# EAGLE schematic A500-EXT-IDE.v1.0.0 (EAGLE 9.0.0)

## Sheet 1 of 2
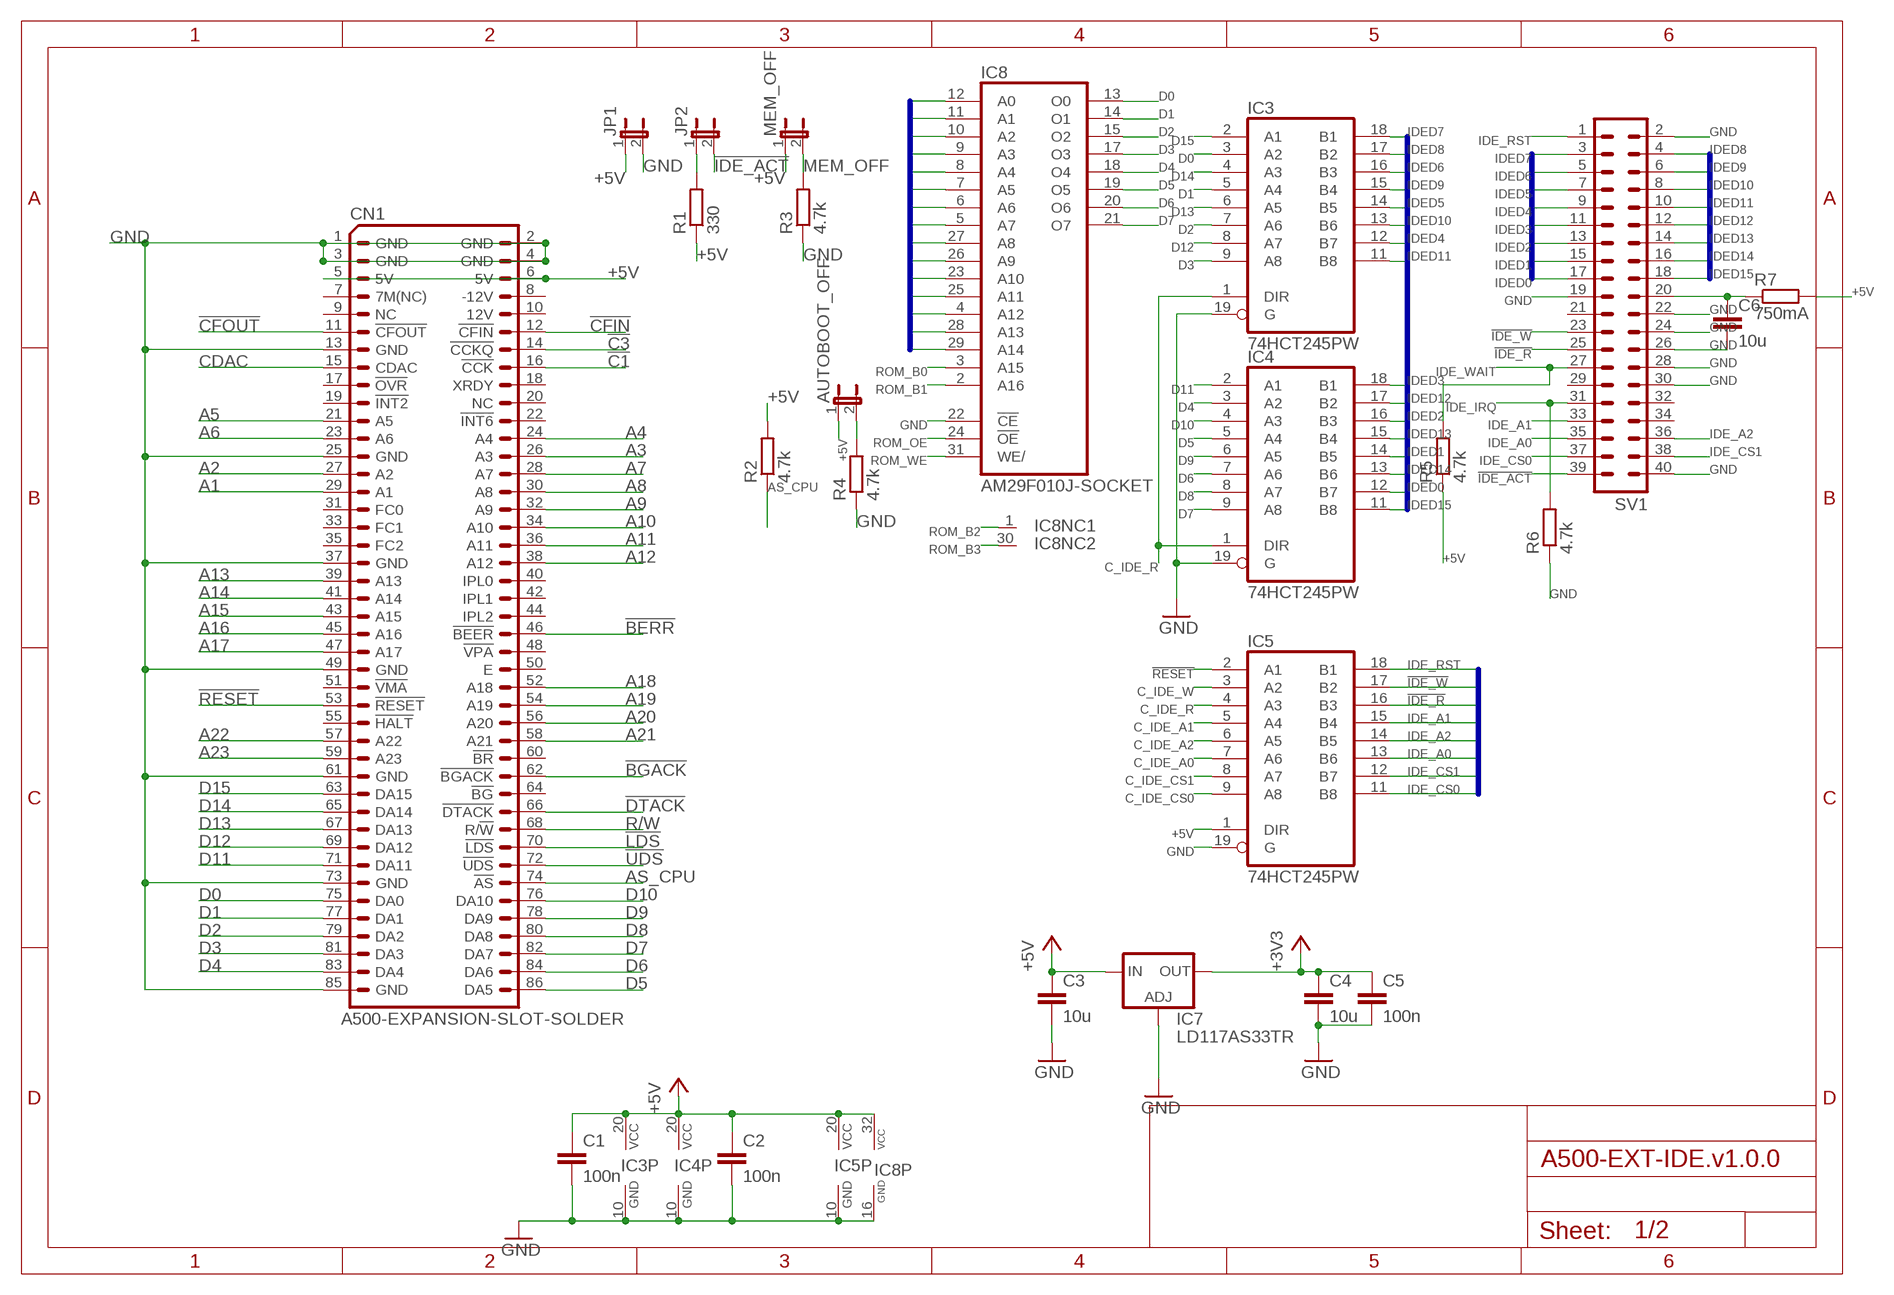
[diagram p0: schematic, sheet 1]

### Parts
AUTOBOOT_OFF  JP1E  [JP1]
C1  100n  C-EUC0603K  [C0603K]
C2  100n  C-EUC0603K  [C0603K]
C3  10u  C-EUC0805K  [C0805K]
C4  10u  C-EUC0805K  [C0805K]
C5  100n  C-EUC0603K  [C0603K]
C6  10u  C-EUC0805K  [C0805K]
CN1  A500-EXPANSION-SLOT-SOLDER  [LKONT_43-SLOT-SOLDER]
IC3  74HCT245PW  [TSSOP20]
IC4  74HCT245PW  [TSSOP20]
IC5  74HCT245PW  [TSSOP20]
IC7  LD117AS33TR  [SOT223]
IC8  AM29F010J-SOCKET  [PLCC-32-SMT-TT]
JP1  JP1E  [JP1]
JP2  JP1E  [JP1]
MEM_OFF  JP1E  [JP1]
R1  330  R-EU_R0603  [R0603]
R2  4.7k  R-EU_R0603  [R0603]
R3  4.7k  R-EU_R0603  [R0603]
R4  4.7k  R-EU_R0603  [R0603]
R5  4.7k  R-EU_R0603  [R0603]
R6  4.7k  R-EU_R0603  [R0603]
R7  750mA  R-EU_R2512  [R2512]
SV1  ML40  [ML40]

### Nets
!BERR: CN1.46(!BEER!) ; also sheet 2
!BGACK: CN1.62(!BGACK!) ; also sheet 2
!C1: CN1.16(!CCK!) ; also sheet 2
!C3: CN1.14(!CCKQ!) ; also sheet 2
!CFIN: CN1.12(!CFIN!) ; also sheet 2
!CFOUT: CN1.11(!CFOUT!) ; also sheet 2
!DTACK: CN1.66(!DTACK!) ; also sheet 2
!IDE_ACT: JP2.2 SV1.39
!IDE_R: IC5.16(B3) SV1.25
!IDE_W: IC5.17(B2) SV1.23
!LDS: CN1.70(!LDS!) ; also sheet 2
!RESET: CN1.53(!RESET!) IC5.2(A1) ; also sheet 2
!UDS: CN1.72(!UDS!) ; also sheet 2
+3V3: C4.1 C5.1 IC7.2(OUT) IC7.4(OUT) ; also sheet 2
+5V: AUTOBOOT_OFF.1 C1.1 C2.1 C3.1 CN1.5(5V) CN1.6(5V) IC3.20(VCC) IC4.20(VCC) IC5.1(DIR) IC5.20(VCC) IC7.3(IN) IC8.32(VCC) JP1.1 MEM_OFF.1 R1.1 R2.2 R5.1 R7.2 ; also sheet 2
A1: CN1.29(A1) IC8.12(A0) ; also sheet 2
A2: CN1.27(A2) IC8.11(A1) ; also sheet 2
A3: CN1.26(A3) IC8.10(A2) ; also sheet 2
A4: CN1.24(A4) IC8.9(A3) ; also sheet 2
A5: CN1.21(A5) IC8.8(A4) ; also sheet 2
A6: CN1.23(A6) IC8.7(A5) ; also sheet 2
A7: CN1.28(A7) IC8.6(A6) ; also sheet 2
A8: CN1.30(A8) IC8.5(A7) ; also sheet 2
A9: CN1.32(A9) IC8.27(A8) ; also sheet 2
A10: CN1.34(A10) IC8.26(A9) ; also sheet 2
A11: CN1.36(A11) IC8.23(A10) ; also sheet 2
A12: CN1.38(A12) IC8.25(A11) ; also sheet 2
A13: CN1.39(A13) IC8.4(A12) ; also sheet 2
A14: CN1.41(A14) IC8.28(A13) ; also sheet 2
A15: CN1.43(A15) IC8.29(A14) ; also sheet 2
A16: CN1.45(A16) ; also sheet 2
A17: CN1.47(A17) ; also sheet 2
A18: CN1.52(A18) ; also sheet 2
A19: CN1.54(A19) ; also sheet 2
A20: CN1.56(A20) ; also sheet 2
A21: CN1.58(A21) ; also sheet 2
A22: CN1.57(A22) ; also sheet 2
A23: CN1.59(A23) ; also sheet 2
AS_CPU: CN1.74(!AS!) R2.1 ; also sheet 2
AUTO_BOOT_OFF: AUTOBOOT_OFF.2 R4.2 ; also sheet 2
C_IDE_A0: IC5.7(A6) ; also sheet 2
C_IDE_A1: IC5.5(A4) ; also sheet 2
C_IDE_A2: IC5.6(A5) ; also sheet 2
C_IDE_CS0: IC5.9(A8) ; also sheet 2
C_IDE_CS1: IC5.8(A7) ; also sheet 2
C_IDE_R: IC3.1(DIR) IC4.1(DIR) IC5.4(A3) ; also sheet 2
C_IDE_W: IC5.3(A2) ; also sheet 2
CDAC: CN1.15(CDAC) ; also sheet 2
D0: CN1.75(DA0) IC3.3(A2) IC8.13(O0) ; also sheet 2
D1: CN1.77(DA1) IC3.5(A4) IC8.14(O1) ; also sheet 2
D2: CN1.79(DA2) IC3.7(A6) IC8.15(O2) ; also sheet 2
D3: CN1.81(DA3) IC3.9(A8) IC8.17(O3) ; also sheet 2
D4: CN1.83(DA4) IC4.3(A2) IC8.18(O4) ; also sheet 2
D5: CN1.86(DA5) IC4.5(A4) IC8.19(O5) ; also sheet 2
D6: CN1.84(DA6) IC4.7(A6) IC8.20(O6) ; also sheet 2
D7: CN1.82(DA7) IC4.9(A8) IC8.21(O7) ; also sheet 2
D8: CN1.80(DA8) IC4.8(A7) ; also sheet 2
D9: CN1.78(DA9) IC4.6(A5) ; also sheet 2
D10: CN1.76(DA10) IC4.4(A3) ; also sheet 2
D11: CN1.71(DA11) IC4.2(A1) ; also sheet 2
D12: CN1.69(DA12) IC3.8(A7) ; also sheet 2
D13: CN1.67(DA13) IC3.6(A5) ; also sheet 2
D14: CN1.65(DA14) IC3.4(A3) ; also sheet 2
D15: CN1.63(DA15) IC3.2(A1) ; also sheet 2
GND: C1.2 C2.2 C3.2 C4.2 C5.2 C6.2 CN1.1(GND) CN1.2(GND) CN1.3(GND) CN1.4(GND) CN1.13(GND) CN1.25(GND) CN1.37(GND) CN1.49(GND) CN1.61(GND) CN1.73(GND) CN1.85(GND) IC3.10(GND) IC3.19(G) IC4.10(GND) IC4.19(G) IC5.10(GND) IC5.19(G) IC7.1(ADJ) IC8.16(GND) IC8.22(!CE) JP1.2 R3.1 R4.1 R6.1 SV1.2 SV1.19 SV1.22 SV1.24 SV1.26 SV1.28 SV1.30 SV1.40 ; also sheet 2
IDE_A0: IC5.13(B6) SV1.35
IDE_A1: IC5.15(B4) SV1.33
IDE_A2: IC5.14(B5) SV1.36
IDE_CS0: IC5.11(B8) SV1.37
IDE_CS1: IC5.12(B7) SV1.38
IDE_IRQ: R6.2 SV1.31 ; also sheet 2
IDE_RST: IC5.18(B1) SV1.1
IDE_WAIT: R5.2 SV1.27 ; also sheet 2
IDED0: IC4.12(B7) SV1.17
IDED1: IC4.14(B5) SV1.15
IDED2: IC4.16(B3) SV1.13
IDED3: IC4.18(B1) SV1.11
IDED4: IC3.12(B7) SV1.9
IDED5: IC3.14(B5) SV1.7
IDED6: IC3.16(B3) SV1.5
IDED7: IC3.18(B1) SV1.3
IDED8: IC3.17(B2) SV1.4
IDED9: IC3.15(B4) SV1.6
IDED10: IC3.13(B6) SV1.8
IDED11: IC3.11(B8) SV1.10
IDED12: IC4.17(B2) SV1.12
IDED13: IC4.15(B4) SV1.14
IDED14: IC4.13(B6) SV1.16
IDED15: IC4.11(B8) SV1.18
KEY_PIN_POWER: C6.1 R7.1 SV1.20
MEM_OFF: MEM_OFF.2 R3.2 ; also sheet 2
N$42: JP2.1 R1.2
R/W: CN1.68(R/!W!) ; also sheet 2
ROM_B0: IC8.3(A15) ; also sheet 2
ROM_B1: IC8.2(A16) ; also sheet 2
ROM_B2: IC8.1(NC) ; also sheet 2
ROM_B3: IC8.30(NC) ; also sheet 2
ROM_OE: IC8.24(!OE) ; also sheet 2
ROM_WE: IC8.31(WE/) ; also sheet 2
Unconnected: CN1.7(7M(NC)) CN1.8(-12V) CN1.9(NC) CN1.10(12V) CN1.17(!OVR!) CN1.18(XRDY) CN1.19(!INT2!) CN1.20(NC) CN1.22(!INT6!) CN1.31(FC0) CN1.33(FC1) CN1.35(FC2) CN1.40(IPL0) CN1.42(IPL1) CN1.44(IPL2) CN1.48(!VPA!) CN1.50(E) CN1.51(!VMA!) CN1.55(!HALT!) CN1.60(!BR!) CN1.64(!BG!) SV1.21 SV1.29 SV1.32 SV1.34

### Buses
IDED[0..15]
IDE_RST,IDE_A[0..2],IDE_CS[0..1],!IDE_R,!IDE_W
A[1..23]

## Sheet 2 of 2
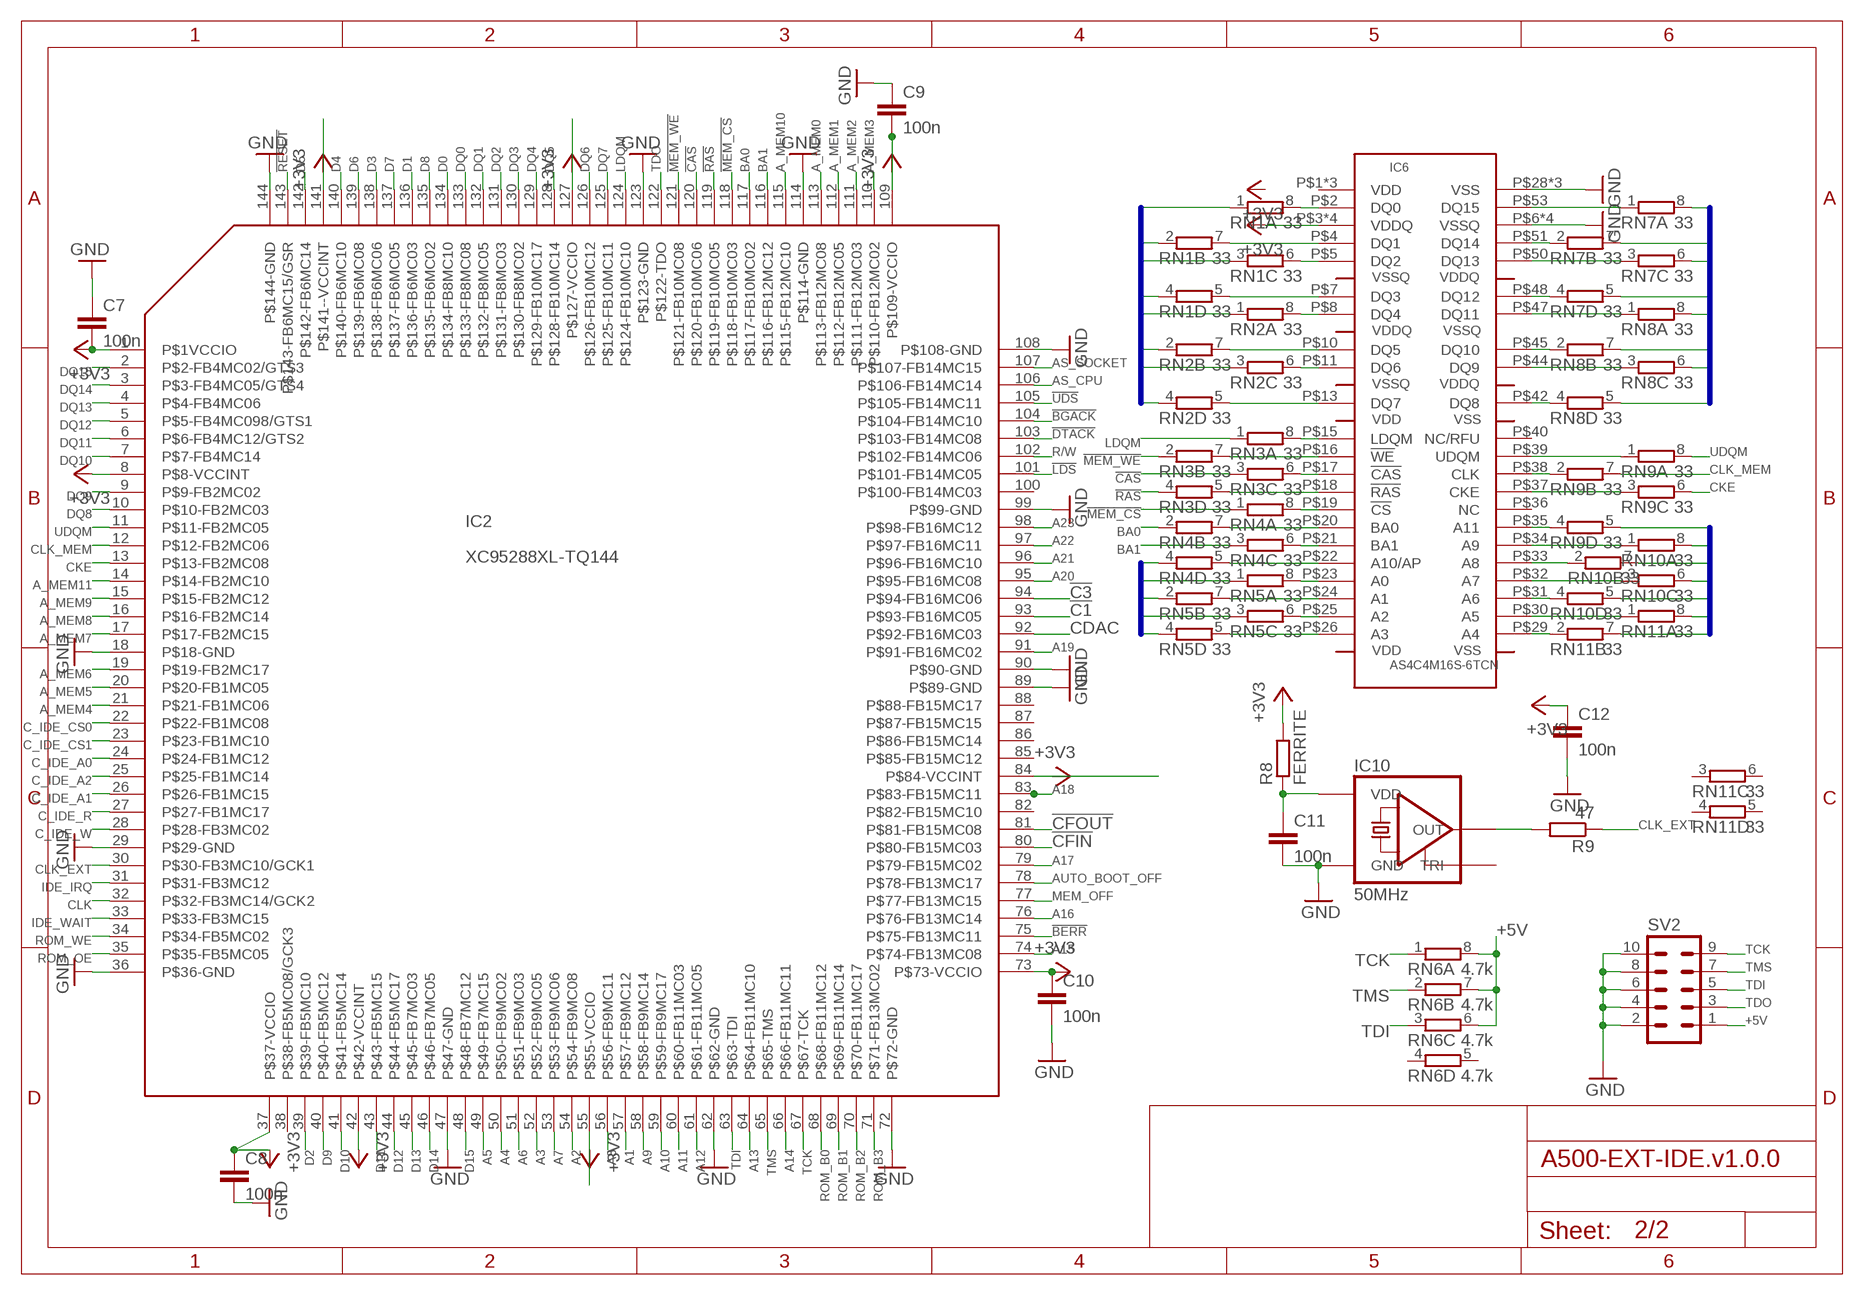
[diagram p1: schematic, sheet 2]

### Parts
C7  100n  C-EUC0603K  [C0603K]
C8  100n  C-EUC0603K  [C0603K]
C9  100n  C-EUC0603K  [C0603K]
C10  100n  C-EUC0603K  [C0603K]
C11  100n  C-EUC0603K  [C0603K]
C12  100n  C-EUC0603K  [C0603K]
IC2  XC95288XL-TQ144  [TQFP144]
IC6  AS4C4M16S-6TCN  [TSOP-2_54]
IC10  50MHz  CSX-750FCFC(5V)  [7X5]
R8  FERRITE  R-EU_R0603  [R0603]
R9  47  R-EU_R0603  [R0603]
RN1  33  4R-NCAY16  [CAY16]
RN2  33  4R-NCAY16  [CAY16]
RN3  33  4R-NCAY16  [CAY16]
RN4  33  4R-NCAY16  [CAY16]
RN5  33  4R-NCAY16  [CAY16]
RN6  4.7k  4R-NCAY16  [CAY16]
RN7  33  4R-NCAY16  [CAY16]
RN8  33  4R-NCAY16  [CAY16]
RN9  33  4R-NCAY16  [CAY16]
RN10  33  4R-NCAY16  [CAY16]
RN11  33  4R-NCAY16  [CAY16]
SV2  ML10L  [ML10L]

### Nets
!BERR: IC2.75(P$75-FB13MC11) ; also sheet 1
!BGACK: IC2.104(P$104-FB14MC10) ; also sheet 1
!C1: IC2.93(P$93-FB16MC05) ; also sheet 1
!C3: IC2.94(P$94-FB16MC06) ; also sheet 1
!CAS: IC2.120(P$120-FB10MC06) RN3.3
!CFIN: IC2.80(P$80-FB15MC03) ; also sheet 1
!CFOUT: IC2.81(P$81-FB15MC08) ; also sheet 1
!DTACK: IC2.103(P$103-FB14MC08) ; also sheet 1
!LDS: IC2.101(P$101-FB14MC05) ; also sheet 1
!MEM_CS: IC2.118(P$118-FB10MC03) RN4.1
!MEM_WE: IC2.121(P$121-FB10MC08) RN3.2
!RAS: IC2.119(P$119-FB10MC05) RN3.4
!RESET: IC2.143(P$143-FB6MC15/GSR) ; also sheet 1
!UDS: IC2.105(P$105-FB14MC11) ; also sheet 1
+3V3: C7.2 C8.1 C9.2 C10.1 C12.1 IC2.1(P$1VCCIO) IC2.8(P$8-VCCINT) IC2.37(P$37-VCCIO) IC2.42(P$42-VCCINT) IC2.55(P$55-VCCIO) IC2.73(P$73-VCCIO) IC2.84(P$84-VCCINT) IC2.109(P$109-VCCIO) IC2.127(P$127-VCCIO) IC2.141(P$141--VCCINT) IC6.P$3(VDDQ) IC6.P$9(VDDQ) IC6.P$43(VDDQ) IC6.P$49(VDDQ) R8.2 ; also sheet 1
+5V: RN6.6 RN6.7 RN6.8 SV2.1 ; also sheet 1
A1: IC2.57(P$57-FB9MC12) ; also sheet 1
A2: IC2.54(P$54-FB9MC08) ; also sheet 1
A3: IC2.52(P$52-FB9MC05) ; also sheet 1
A4: IC2.50(P$50-FB9MC02) ; also sheet 1
A5: IC2.49(P$49-FB7MC15) ; also sheet 1
A6: IC2.51(P$51-FB9MC03) ; also sheet 1
A7: IC2.53(P$53-FB9MC06) ; also sheet 1
A8: IC2.56(P$56-FB9MC11) ; also sheet 1
A9: IC2.58(P$58-FB9MC14) ; also sheet 1
A10: IC2.59(P$59-FB9MC17) ; also sheet 1
A11: IC2.60(P$60-FB11MC03) ; also sheet 1
A12: IC2.61(P$61-FB11MC05) ; also sheet 1
A13: IC2.64(P$64-FB11MC10) ; also sheet 1
A14: IC2.66(P$66-FB11MC11) ; also sheet 1
A15: IC2.74(P$74-FB13MC08) ; also sheet 1
A16: IC2.76(P$76-FB13MC14) ; also sheet 1
A17: IC2.79(P$79-FB15MC02) ; also sheet 1
A18: IC2.83(P$83-FB15MC11) ; also sheet 1
A19: IC2.91(P$91-FB16MC02) ; also sheet 1
A20: IC2.95(P$95-FB16MC08) ; also sheet 1
A21: IC2.96(P$96-FB16MC10) ; also sheet 1
A22: IC2.97(P$97-FB16MC11) ; also sheet 1
A23: IC2.98(P$98-FB16MC12) ; also sheet 1
A_MEM0: IC2.113(P$113-FB12MC08) RN5.1
A_MEM1: IC2.112(P$112-FB12MC05) RN5.2
A_MEM2: IC2.111(P$111-FB12MC03) RN5.3
A_MEM3: IC2.110(P$110-FB12MC02) RN5.4
A_MEM4: IC2.21(P$21-FB1MC06) RN11.7
A_MEM5: IC2.20(P$20-FB1MC05) RN11.8
A_MEM6: IC2.19(P$19-FB2MC17) RN10.5
A_MEM7: IC2.17(P$17-FB2MC15) RN10.6
A_MEM8: IC2.16(P$16-FB2MC14) RN10.7
A_MEM9: IC2.15(P$15-FB2MC12) RN10.8
A_MEM10: IC2.115(P$115-FB12MC10) RN4.4
A_MEM11: IC2.14(P$14-FB2MC10) RN9.5
AS_CPU: IC2.106(P$106-FB14MC14) ; also sheet 1
AS_SOCKET: IC2.107(P$107-FB14MC15)
AUTO_BOOT_OFF: IC2.78(P$78-FB13MC17) ; also sheet 1
BA0: IC2.117(P$117-FB10MC02) RN4.2
BA1: IC2.116(P$116-FB12MC12) RN4.3
C_IDE_A0: IC2.24(P$24-FB1MC12) ; also sheet 1
C_IDE_A1: IC2.26(P$26-FB1MC15) ; also sheet 1
C_IDE_A2: IC2.25(P$25-FB1MC14) ; also sheet 1
C_IDE_CS0: IC2.22(P$22-FB1MC08) ; also sheet 1
C_IDE_CS1: IC2.23(P$23-FB1MC10) ; also sheet 1
C_IDE_R: IC2.27(P$27-FB1MC17) ; also sheet 1
C_IDE_W: IC2.28(P$28-FB3MC02) ; also sheet 1
CDAC: IC2.92(P$92-FB16MC03) ; also sheet 1
CKE: IC2.13(P$13-FB2MC08) RN9.6
CLK: IC2.32(P$32-FB3MC14/GCK2)
CLK_EXT: IC2.30(P$30-FB3MC10/GCK1) R9.1
CLK_MEM: IC2.12(P$12-FB2MC06) RN9.7
D0: IC2.134(P$134-FB8MC10) ; also sheet 1
D1: IC2.136(P$136-FB6MC03) ; also sheet 1
D2: IC2.39(P$39-FB5MC10) ; also sheet 1
D3: IC2.138(P$138-FB6MC06) ; also sheet 1
D4: IC2.140(P$140-FB6MC10) ; also sheet 1
D5: IC2.142(P$142-FB6MC14) ; also sheet 1
D6: IC2.139(P$139-FB6MC08) ; also sheet 1
D7: IC2.137(P$137-FB6MC05) ; also sheet 1
D8: IC2.135(P$135-FB6MC02) ; also sheet 1
D9: IC2.40(P$40-FB5MC12) ; also sheet 1
D10: IC2.41(P$41-FB5MC14) ; also sheet 1
D11: IC2.43(P$43-FB5MC15) ; also sheet 1
D12: IC2.44(P$44-FB5MC17) ; also sheet 1
D13: IC2.45(P$45-FB7MC03) ; also sheet 1
D14: IC2.46(P$46-FB7MC05) ; also sheet 1
D15: IC2.48(P$48-FB7MC12) ; also sheet 1
DQ0: IC2.133(P$133-FB8MC08) RN1.1
DQ1: IC2.132(P$132-FB8MC05) RN1.2
DQ2: IC2.131(P$131-FB8MC03) RN1.3
DQ3: IC2.130(P$130-FB8MC02) RN1.4
DQ4: IC2.129(P$129-FB10MC17) RN2.1
DQ5: IC2.128(P$128-FB10MC14) RN2.2
DQ6: IC2.126(P$126-FB10MC12) RN2.3
DQ7: IC2.125(P$125-FB10MC11) RN2.4
DQ8: IC2.10(P$10-FB2MC03) RN8.5
DQ9: IC2.9(P$9-FB2MC02) RN8.6
DQ10: IC2.7(P$7-FB4MC14) RN8.7
DQ11: IC2.6(P$6-FB4MC12/GTS2) RN8.8
DQ12: IC2.5(P$5-FB4MC098/GTS1) RN7.5
DQ13: IC2.4(P$4-FB4MC06) RN7.6
DQ14: IC2.3(P$3-FB4MC05/GTS4) RN7.7
DQ15: IC2.2(P$2-FB4MC02/GTS3) RN7.8
GND: C7.1 C8.2 C9.1 C10.2 C11.2 C12.2 IC2.18(P$18-GND) IC2.29(P$29-GND) IC2.36(P$36-GND) IC2.47(P$47-GND) IC2.62(P$62-GND) IC2.72(P$72-GND) IC2.89(P$89-GND) IC2.90(P$90-GND) IC2.99(P$99-GND) IC2.108(P$108-GND) IC2.114(P$114-GND) IC2.123(P$123-GND) IC2.144(P$144-GND) IC6.P$6(VSSQ) IC6.P$12(VSSQ) IC6.P$28(VSS) IC6.P$41(VSS) IC6.P$46(VSSQ) IC6.P$52(VSSQ) IC6.P$54(VSS) IC10.P$2(GND) SV2.2 SV2.4 SV2.6 SV2.8 SV2.10 ; also sheet 1
IDE_IRQ: IC2.31(P$31-FB3MC12) ; also sheet 1
IDE_WAIT: IC2.33(P$33-FB3MC15) ; also sheet 1
LDQM: IC2.124(P$124-FB10MC10) RN3.1
MEM_OFF: IC2.77(P$77-FB13MC15) ; also sheet 1
N$1: IC6.P$26(A3) RN5.5
N$2: IC6.P$25(A2) RN5.6
N$3: IC6.P$24(A1) RN5.7
N$4: IC6.P$23(A0) RN5.8
N$5: IC6.P$22(A10/AP) RN4.5
N$6: IC6.P$21(BA1) RN4.6
N$7: IC6.P$20(BA0) RN4.7
N$8: IC6.P$19(!CS) RN4.8
N$9: IC6.P$18(!RAS) RN3.5
N$10: IC6.P$17(!CAS) RN3.6
N$11: IC6.P$16(!WE) RN3.7
N$12: IC6.P$15(LDQM) RN3.8
N$13: IC6.P$13(DQ7) RN2.5
N$14: IC6.P$11(DQ6) RN2.6
N$15: IC6.P$10(DQ5) RN2.7
N$16: IC6.P$8(DQ4) RN2.8
N$17: IC6.P$7(DQ3) RN1.5
N$18: IC6.P$5(DQ2) RN1.6
N$19: IC6.P$4(DQ1) RN1.7
N$20: IC6.P$2(DQ0) RN1.8
N$21: IC6.P$53(DQ15) RN7.1
N$22: IC6.P$51(DQ14) RN7.2
N$23: IC6.P$50(DQ13) RN7.3
N$24: IC6.P$48(DQ12) RN7.4
N$25: IC6.P$47(DQ11) RN8.1
N$26: IC6.P$45(DQ10) RN8.2
N$27: IC6.P$44(DQ9) RN8.3
N$28: IC6.P$42(DQ8) RN8.4
N$29: IC6.P$39(UDQM) RN9.1
N$30: IC6.P$38(CLK) RN9.2
N$31: IC6.P$37(CKE) RN9.3
N$32: IC6.P$35(A11) RN9.4
N$33: IC6.P$34(A9) RN10.1
N$34: IC6.P$33(A8) RN10.2
N$35: IC6.P$32(A7) RN10.3
N$36: IC6.P$31(A6) RN10.4
N$37: IC6.P$30(A5) RN11.1
N$38: IC6.P$29(A4) RN11.2
N$39: IC10.P$3(OUT) R9.2
R/W: IC2.102(P$102-FB14MC06) ; also sheet 1
ROM_B0: IC2.68(P$68-FB11MC12) ; also sheet 1
ROM_B1: IC2.69(P$69-FB11MC14) ; also sheet 1
ROM_B2: IC2.70(P$70-FB11MC17) ; also sheet 1
ROM_B3: IC2.71(P$71-FB13MC02) ; also sheet 1
ROM_OE: IC2.35(P$35-FB5MC05) ; also sheet 1
ROM_WE: IC2.34(P$34-FB5MC02) ; also sheet 1
TCK: IC2.67(P$67-TCK) RN6.1 SV2.9
TDI: IC2.63(P$63-TDI) RN6.3 SV2.5
TDO: IC2.122(P$122-TDO) SV2.3
TMS: IC2.65(P$65-TMS) RN6.2 SV2.7
UDQM: IC2.11(P$11-FB2MC05) RN9.8
VCC-X: C11.1 IC10.P$4(VDD) R8.1
Unconnected: IC2.38(P$38-FB5MC08/GCK3) IC2.82(P$82-FB15MC10) IC2.85(P$85-FB15MC12) IC2.86(P$86-FB15MC14) IC2.87(P$87-FB15MC15) IC2.88(P$88-FB15MC17) IC2.100(P$100-FB14MC03) IC6.P$1(VDD) IC6.P$14(VDD) IC6.P$27(VDD) IC6.P$36(NC) IC6.P$40(NC/RFU) IC10.P$1(TRI) RN6.4 RN6.5 RN11.3 RN11.4 RN11.5 RN11.6

### Buses
DQ[0..15]
A_MEM[0..11]

## Library data of the parts
AUTOBOOT_OFF JP1 JP2 MEM_OFF = jumper:JP1E: JUMPER
C1-C12 = rcl:C-EU: CAPACITOR, European symbol
CN1 = amiga:A500-EXPANSION
IC2 = xilinx_xc9572xl-tq100:XC95288XL-TQ144
IC3-IC5 = 74xx-eu:74*245: Octal BUS TRANSCEIVER, 3-state
IC6 = Alliance_Memory_By_element14_Batch_1:AS4C4M16S-6TCN
IC7 = v-reg:LD117A?*: Low drop fixed and adjustable positive voltage regulators 1 A Source: http://www.st.com/stonline/products/literature/ds/7194/ld1117axx.pdf
IC8 = am29-memory:AM29F010*: 1-Megabit FLASH MEMORY (128 K x 8 bit) 5 V-only
IC10 = SMD-Crystal:CSX-750FC: CITIZEN Crystal Clock Oscilator from http://cfm.citizen.co.jp/english/product/pdf/CSX-750F.pdf
R1-R9 = rcl:R-EU_: RESISTOR, European symbol
RN1-RN11 = resistor-dil:4R-N: Array Chip Resistor Source: RS Component / Phycomp; OC_FARNELL: unknown; OC_NEWARK: unknown
SV1 = con-harting-ml:ML40: HARTING; OC_FARNELL: unknown; OC_NEWARK: unknown
SV2 = con-harting-ml:ML10: HARTING; OC_FARNELL: unknown; OC_NEWARK: unknown